# Altium schematic sheet P01_mpsm.SchDoc: Pixhawk Power Supply Module (PSM)
size C; SheetNumber: 1
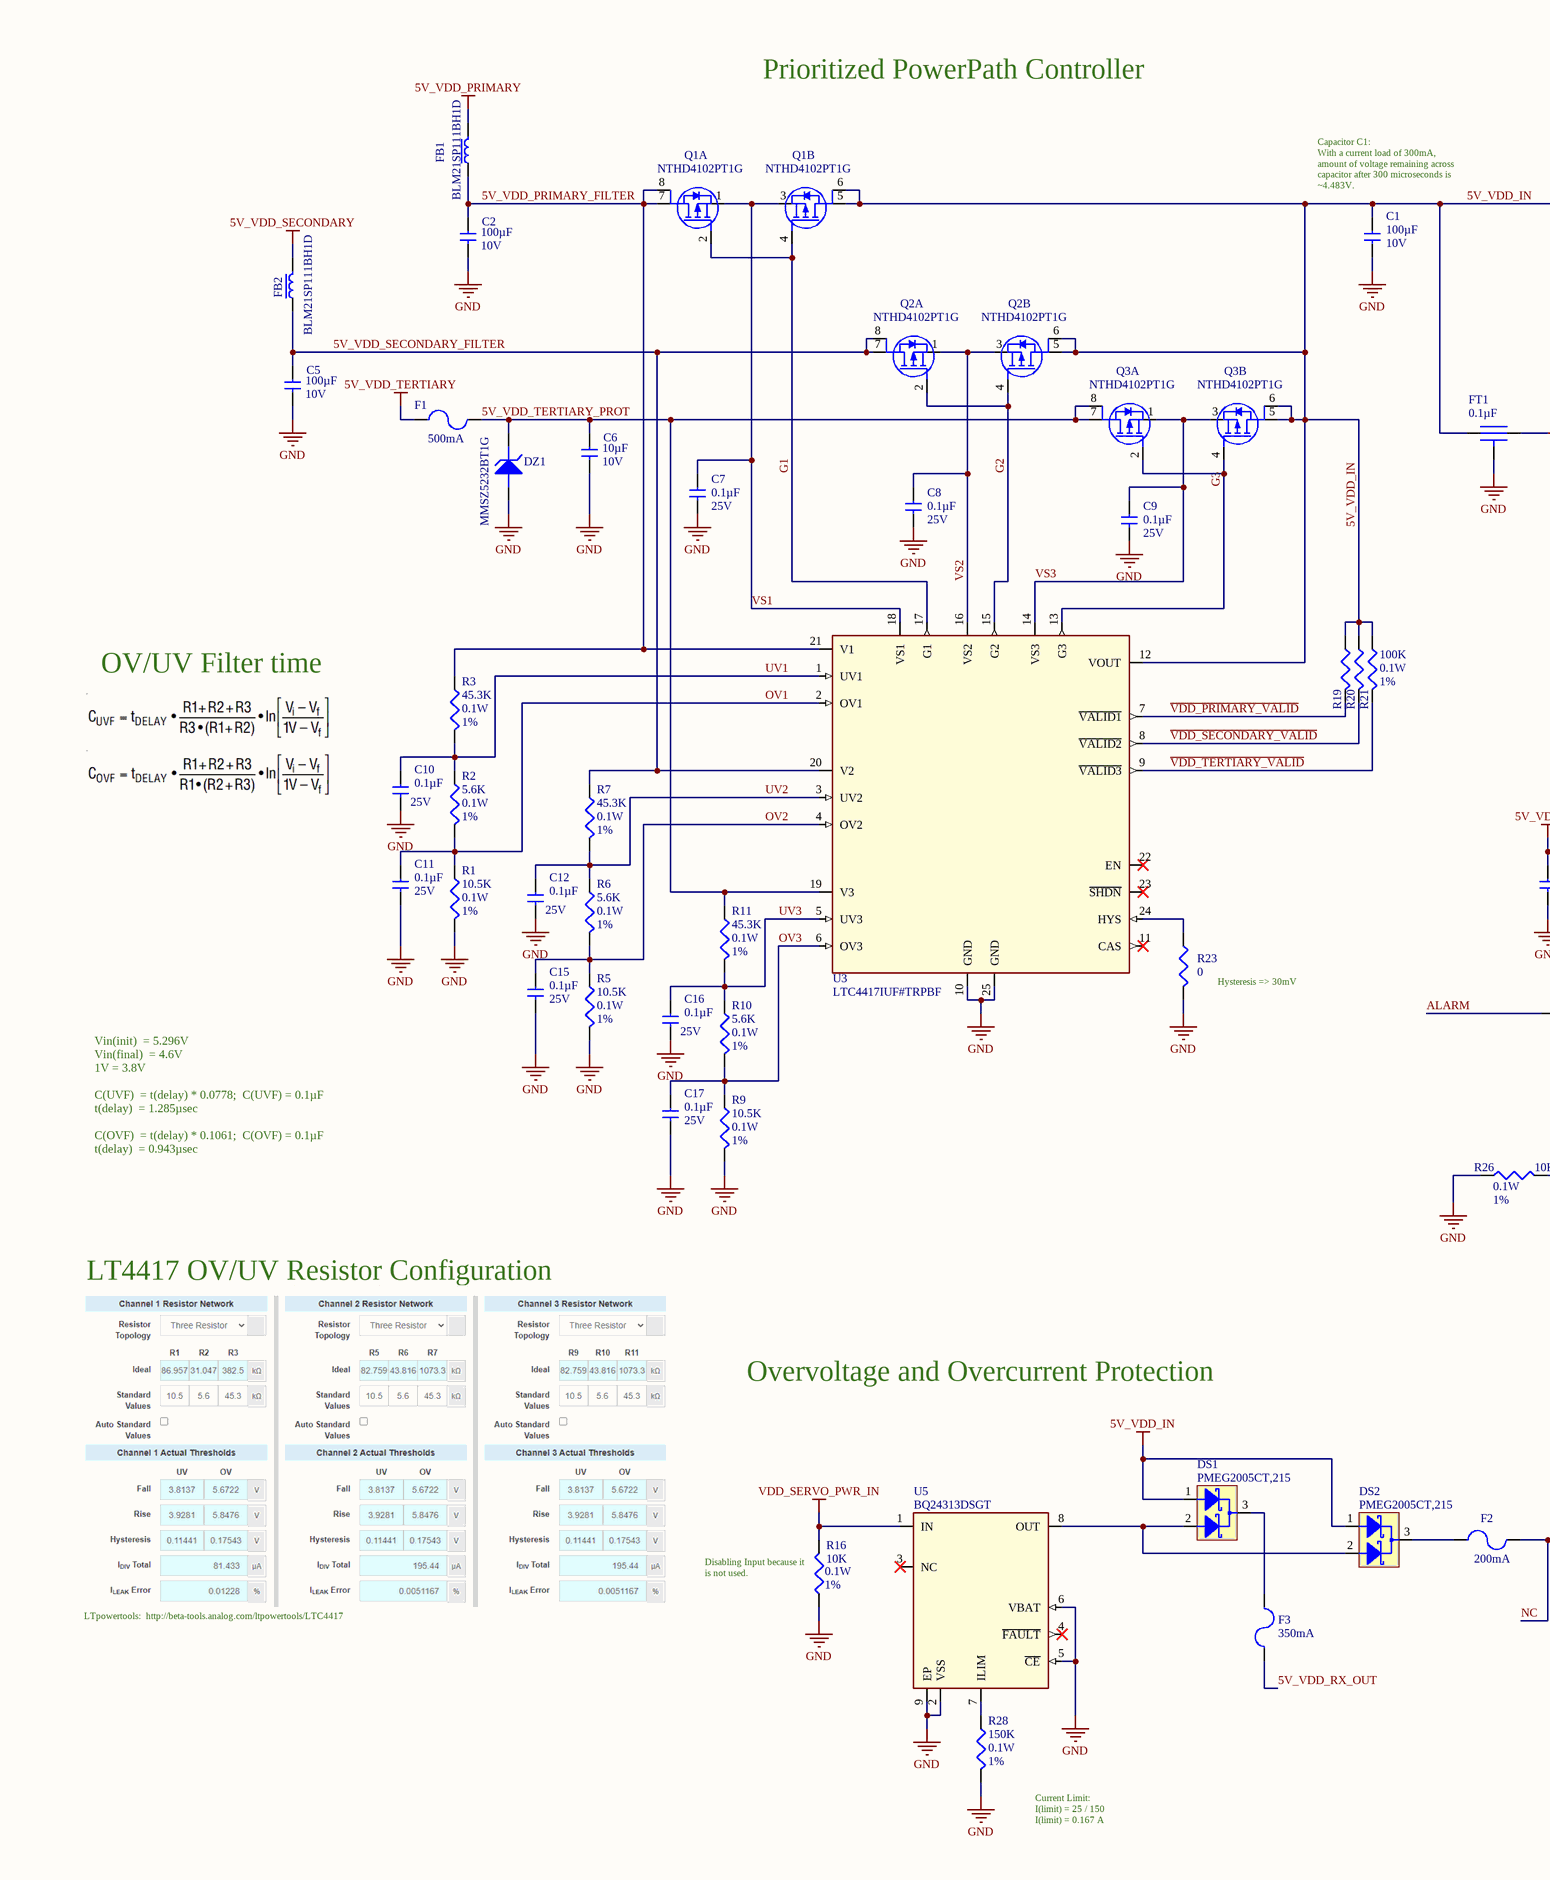
[diagram p0: P01_mpsm.SchDoc, left]
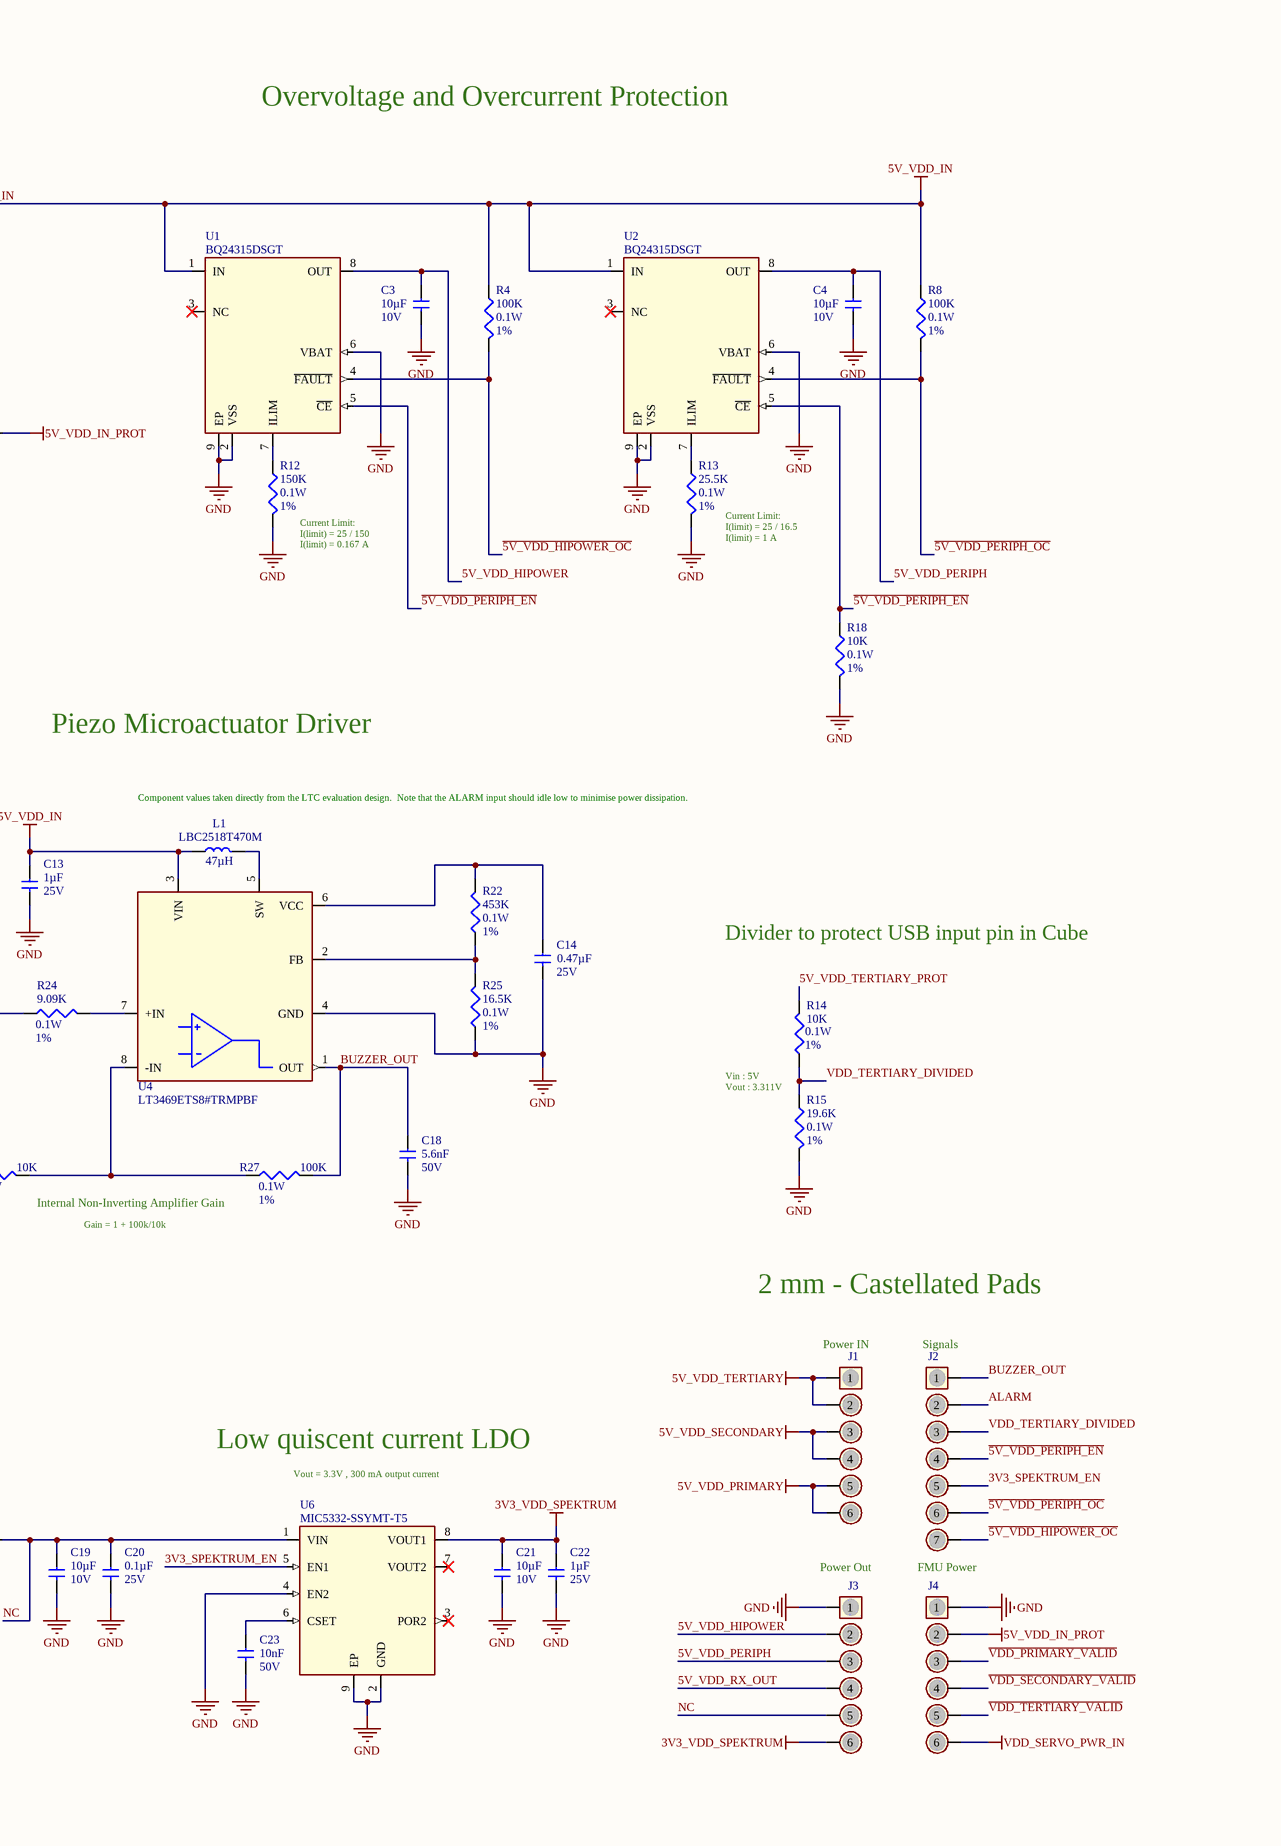
[diagram p1: P01_mpsm.SchDoc, right]

## Parts
C1  100µF  Voltage: 10V  [CC-1206]
C2  100µF  Voltage: 10V  [CC-1206]
C3  10µF  Voltage: 10V  [CC-0603]
C4  10µF  Voltage: 10V  [CC-0603]
C5  100µF  Voltage: 10V  [CC-1206]
C6  10µF  Voltage: 10V  [CC-0603]
C7  0.1µF  Voltage: 25V  [CC-0402]
C8  0.1µF  Voltage: 25V  [CC-0402]
C9  0.1µF  Voltage: 25V  [CC-0402]
C10  0.1µF  Voltage: 25V  [CC-0402]
C11  0.1µF  Voltage: 25V  [CC-0402]
C12  0.1µF  Voltage: 25V  [CC-0402]
C13  1µF  Voltage: 25V  [CC-0402]
C14  0.47µF  Voltage: 25V  [CC-0402]
C15  0.1µF  Voltage: 25V  [CC-0402]
C16  0.1µF  Voltage: 25V  [CC-0402]
C17  0.1µF  Voltage: 25V  [CC-0402]
C18  5.6nF  Voltage: 50V  [CC-0402]
C19  10µF  Voltage: 10V  [CC-0603]
C20  0.1µF  Voltage: 25V  [CC-0402]
C21  10µF  Voltage: 10V  [CC-0603]
C22  1µF  Voltage: 25V  [CC-0402]
C23  10nF  Voltage: 50V  [CC-0402]
DS1  PMEG2005CT,215  [SOT-23-3]
DS2  PMEG2005CT,215  [SOT-23-3]
DZ1  MMSZ5232BT1G  [SOD-123]
F1  500mA  [CF-0402]
F2  200mA  [CF-1206]
F3  350mA  [CF-1206]
FB1  BLM21SP111BH1D  [FB-0805]
FB2  BLM21SP111BH1D  [FB-0805]
FT1  0.1µF  [CF-0603 - 3PC-PAD]
J1  6 Contacts  [1X06M]  (value not drawn)  (no BOM)
J2  7 Contacts  [1X07M]  (value not drawn)  (no BOM)
J3  6 Contacts  [1X06M]  (value not drawn)  (no BOM)
J4  6 Contacts  [1X06M]  (value not drawn)  (no BOM)
L1  LBC2518T470M  Inductance: 47µH  [IND-1007]
Q1  NTHD4102PT1G  [1206-8_8-SMD]  (parts A,B of 2)
Q2  NTHD4102PT1G  [1206-8_8-SMD]  (parts A,B of 2)
Q3  NTHD4102PT1G  [1206-8_8-SMD]  (parts A,B of 2)
R1  10.5K  Power: 0.1W  Tolerance: 1%  [CR-0402]
R2  5.6K  Power: 0.1W  Tolerance: 1%  [CR-0402]
R3  45.3K  Power: 0.1W  Tolerance: 1%  [CR-0402]
R4  100K  Power: 0.1W  Tolerance: 1%  [CR-0402]
R5  10.5K  Power: 0.1W  Tolerance: 1%  [CR-0402]
R6  5.6K  Power: 0.1W  Tolerance: 1%  [CR-0402]
R7  45.3K  Power: 0.1W  Tolerance: 1%  [CR-0402]
R8  100K  Power: 0.1W  Tolerance: 1%  [CR-0402]
R9  10.5K  Power: 0.1W  Tolerance: 1%  [CR-0402]
R10  5.6K  Power: 0.1W  Tolerance: 1%  [CR-0402]
R11  45.3K  Power: 0.1W  Tolerance: 1%  [CR-0402]
R12  150K  Power: 0.1W  Tolerance: 1%  [CR-0402]
R13  25.5K  Power: 0.1W  Tolerance: 1%  [CR-0402]
R14  10K  Power: 0.1W  Tolerance: 1%  [CR-0402]
R15  19.6K  Power: 0.1W  Tolerance: 1%  [CR-0402]
R16  10K  Power: 0.1W  Tolerance: 1%  [CR-0402]
R18  10K  Power: 0.1W  Tolerance: 1%  [CR-0402]
R19  100K  [CR-0402]  (value not drawn)
R20  100K  [CR-0402]  (value not drawn)
R21  100K  Power: 0.1W  Tolerance: 1%  [CR-0402]
R22  453K  Power: 0.1W  Tolerance: 1%  [CR-0402]
R23  0  [CR-0402]
R24  9.09K  Power: 0.1W  Tolerance: 1%  [CR-0402]
R25  16.5K  Power: 0.1W  Tolerance: 1%  [CR-0402]
R26  10K  Power: 0.1W  Tolerance: 1%  [CR-0402]
R27  100K  Power: 0.1W  Tolerance: 1%  [CR-0402]
R28  150K  Power: 0.1W  Tolerance: 1%  [CR-0402]
U1  BQ24315DSGT  [8-WFDFN_2x2]
U2  BQ24315DSGT  [8-WFDFN_2x2]
U3  LTC4417IUF#TRPBF  [QFN-24_2x2]
U4  LT3469ETS8#TRMPBF  [SOT-23-8]
U5  BQ24313DSGT  [8-WFDFN_2x2]
U6  MIC5332-SSYMT-T5  [MLF-8_2x2]

## Nets
3V3_VDD_SPEKTRUM: C21.1 C22.1 J3.6 U6.8(VOUT1)
5V_VDD_IN: C1.1 C13.1 DS1.1(A1) DS2.1(A1) FT1.1 L1.1 Q1.5(D2) Q1.6(D2) Q2.5(D2) Q2.6(D2) Q3.5(D2) Q3.6(D2) R4.1 R8.1 R19.1 R20.1 R21.1 U1.1(IN) U2.1(IN) U3.12(VOUT) U4.3(VIN)
5V_VDD_IN_PROT: FT1.2 J4.2
5V_VDD_PRIMARY: FB1.2 J1.5 J1.6
5V_VDD_SECONDARY: FB2.2 J1.3 J1.4
5V_VDD_TERTIARY: F1.2(NEG) J1.1 J1.2
GND: C1.2 C2.2 C3.2 C4.2 C5.2 C6.2 C7.2 C8.2 C9.2 C10.2 C11.2 C12.2 C13.2 C14.2 C15.2 C16.2 C17.2 C18.2 C19.2 C20.2 C21.2 C22.2 C23.2 DZ1.A FT1.GND J3.1 J4.1 R1.2 R5.2 R9.2 R12.2 R13.2 R15.2 R16.1 R18.2 R23.2 R25.1 R26.1 R28.2 U1.2(VSS) U1.6(VBAT) U1.9(EP) U2.2(VSS) U2.6(VBAT) U2.9(EP) U3.10(GND) U3.25(GND) U4.4(GND) U5.2(VSS) U5.5(~{CE}) U5.6(VBAT) U5.9(EP) U6.2(GND) U6.4(EN2) U6.9(EP)
VDD_SERVO_PWR_IN: J4.6 R16.2 U5.1(IN)
3V3_SPEKTRUM_EN: J2.5 U6.5(EN1)
~{5V_VDD_HIPOWER_OC}: J2.7 R4.2 U1.4(~{FAULT})
~{5V_VDD_PERIPH_EN}: J2.4 R18.1 U1.5(~{CE}) U2.5(~{CE})
~{5V_VDD_PERIPH_OC}: J2.6 R8.2 U2.4(~{FAULT})
5V_VDD_HIPOWER: C3.1 J3.2 U1.8(OUT)
5V_VDD_PERIPH: C4.1 J3.3 U2.8(OUT)
5V_VDD_PRIMARY_FILTER: C2.1 FB1.1 Q1.7(D1) Q1.8(D1) R3.1 U3.21(V1)
5V_VDD_RX_OUT: F3.1 J3.4
5V_VDD_SECONDARY_FILTER: C5.1 FB2.1 Q2.7(D1) Q2.8(D1) R7.1 U3.20(V2)
5V_VDD_TERTIARY_PROT: C6.1 DZ1.K F1.1(POS) Q3.7(D1) Q3.8(D1) R11.1 R14.2 U3.19(V3)
ALARM: J2.2 R24.1
BUZZER_OUT: C18.1 J2.1 R27.2 U4.1(OUT)
G1: Q1.2(G1) Q1.4(G2) U3.17(G1)
G2: Q2.2(G1) Q2.4(G2) U3.15(G2)
G3: Q3.2(G1) Q3.4(G2) U3.13(G3)
NC: C19.1 C20.1 F2.2 J3.5 U6.1(VIN)
OV1: C11.1 R1.1 R2.2 U3.2(OV1)
OV2: C15.1 R5.1 R6.2 U3.4(OV2)
OV3: C17.1 R9.1 R10.2 U3.6(OV3)
UV1: C10.1 R2.1 R3.2 U3.1(UV1)
UV2: C12.1 R6.1 R7.2 U3.3(UV2)
UV3: C16.1 R10.1 R11.2 U3.5(UV3)
~{VDD_PRIMARY_VALID}: J4.3 R19.2 U3.7(~{VALID1})
~{VDD_SECONDARY_VALID}: J4.4 R20.2 U3.8(~{VALID2})
~{VDD_TERTIARY_VALID}: J4.5 R21.2 U3.9(~{VALID3})
VDD_TERTIARY_DIVIDED: J2.3 R14.1 R15.1
VS1: C7.1 Q1.1(S1) Q1.3(S2) U3.18(VS1)
VS2: C8.1 Q2.1(S1) Q2.3(S2) U3.16(VS2)
VS3: C9.1 Q3.1(S1) Q3.3(S2) U3.14(VS3)
NetC14_1: C14.1 R22.2 U4.6(VCC)
NetC23_1: C23.1 U6.6(CSET)
NetDS1_2: DS1.2(A2) DS2.2(A2) U5.8(OUT)
NetDS1_3: DS1.3(C) F3.2
NetDS2_3: DS2.3(C) F2.1
NetL1_2: L1.2 U4.5(SW)
NetR12_1: R12.1 U1.7(ILIM)
NetR13_1: R13.1 U2.7(ILIM)
NetR22_1: R22.1 R25.2 U4.2(FB)
NetR23_1: R23.1 U3.24(HYS)
NetR24_2: R24.2 U4.7(+IN)
NetR26_2: R26.2 R27.1 U4.8(-IN)
NetR28_1: R28.1 U5.7(ILIM)

Not connected (* = marked no-connect by the designer): U1 3(NC)*; U2 3(NC)*; U3 11(CAS)* 22(EN)* 23(~{SHDN})*; U5 3(NC)* 4(~{FAULT})*; U6 3(POR2)* 7(VOUT2)*

## Notes on the sheet
- Prioritized PowerPath Controller
- Overvoltage and Overcurrent Protection
- (near C1) Capacitor C1:
  With a current load of 300mA,
  amount of voltage remaining across capacitor after 300 microseconds is ~4.483V.
- (near R12) Current Limit:
  I(limit) = 25 / 150
  I(limit) = 0.167 A
- (near R13) Current Limit:
  I(limit) = 25 / 16.5
  I(limit) = 1 A
- OV/UV Filter time
- Piezo Microactuator Driver
- (near L1) Component values taken directly from
  the LTC evaluation design.
  Note that the ALARM input should idle
  low to minimise power dissipation.
- Divider to protect USB input pin in Cube
- (near R23) Hysteresis => 30mV
- Vin : 5V
  Vout : 3.311V
- Vin(init) 	= 5.296V
  Vin(final) 	= 4.6V
  1V	= 3.8V
  C(UVF) 	= t(delay) * 0.0778; 	C(UVF) = 0.1µF
  t(delay) 	= 1.285µsec
  C(OVF) 	= t(delay) * 0.1061; 	C(OVF) = 0.1µF
  t(delay) 	= 0.943µsec
- Internal Non-Inverting Amplifier Gain
- LT4417 OV/UV Resistor Configuration
- Gain = 1 + 100k/10k
- 2 mm - Castellated Pads
- (near J1) Power IN
- (near J2) Signals
- Vout = 3.3V , 300 mA output current
- Low quiscent current LDO
- LTpowertools:  http://beta-tools.analog.com/ltpowertools/LTC4417
- (near R16) Disabling Input because it is not used.
- Power Out
- FMU Power
- Current Limit:
  I(limit) = 25 / 150
  I(limit) = 0.167 A
- Title
- Assembly Number:
- Revision
- PROPRIETRY & CONFIDENTIAL
  THE INFORMATION CONTAINS IN THIS DRAWING
  IS THE SOLE PROPERTY OF  MATTERNET Inc.
  ANY REPRODUCTION IN PART OR AS WHOLE
  WITHOUT A WRITTEN PERMISSION OF
  MATTERNET Inc. IS PROHIBITED
- Size:
- Date:
- File:
- C
- Fabrication Number:
- Time:
- Sheet
- of

## Library data of the parts
C1 C2 C5 = CC-100µF-X5R-10V-20%-1206: DESC: 100µF ±20% 10V Ceramic Capacitor X5R 1206 (3216 Metric); MFG: TDK Corporation; MFG_PN: C3216X5R1A107M160AC; Tolerance: 20%
C3 C4 C6 C19 C21 = CC-10µF-X7T-10V-10%-0603: DESC: 10µF ±10% 10V Ceramic Capacitor X7T 0603 (1608 Metric); MFG: Murata Electronics; MFG_PN: GRM188D71A106KA73D; Tolerance: 10%
C7-C12 C15-C17 C20 = CC-0.1µF-X7R-25V-10%-0402: DESC: 0.1µF ±10% 25V Ceramic Capacitor X7R 0402 (1005 Metric); MFG: Murata Electronics; MFG_PN: GRM155R71E104KE14D; Tolerance: 10%
C13 C22 = CC-1µF-X6S-25V-10%-0402: DESC: 1µF ±10% 25V Ceramic Capacitor X6S 0402 (1005 Metric); MFG: Murata Electronics; MFG_PN: GRT155C81E105KE13D; Tolerance: 10%
C14 = CC-0.47µF-X5R-25V-10%-0402: Tolerance: ±10%; DESC: 0.47µF ±10% 25V Ceramic Capacitor X5R 0402 (1005 Metric); MFG: Murata Electronics; MFG_PN: GRT155R61E474KE01D
C18 = CC-5.6nF-X7R-50V-5%-0402: Tolerance: ±10%; DESC: 5600pF ±5% 50V Ceramic Capacitor X7R 0402 (1005 Metric); MFG: Yageo; MFG_PN: CC0402JRX7R9BB562
C23 = CC-10nF-X7R-50V-10%-0402: Tolerance: ±10%; DESC: 10000pF ±10% 50V Ceramic Capacitor X7R 0402 (1005 Metric); MFG: Murata Electronics; MFG_PN: GRM155R71H103KA88D
DS1 DS2 = DS-PMEG2005CT,215-SOT-23-3: MFG: Nexperia USA Inc.; DESC: Diode Array 1 Pair Common Cathode Schottky 20V 500mA Surface Mount TO-236-3, SC-59, SOT-23-3; MFG_PN: PMEG2005CT,215
DZ1 = DZ-5.6V-MMSZ5232BT1G-SOD-123: MFG: ON Semiconductor; DESC: Zener Diode 5.6V 500mW ±5% Surface Mount SOD-123; MFG_PN: MMSZ5232BT1G
F1 = FUSE-500mA-32V-0402: DESC: FUSE BOARD MNT 500MA 24VDC 0402; MFG: BOURNS; MFG_PN: SF-0402F050-2
F2 = FUSE-200mA-20V-1206: DESC: Polymeric PTC Resettable Fuse 30V 200mA Ih Surface Mount 1206 (3216 Metric), Concave; MFG: Bel Fuse Inc.; MFG_PN: 0ZCJ0020FF2E
F3 = FUSE-350mA-16V-1206: DESC: Polymeric PTC Resettable Fuse 16V 350mA Ih Surface Mount 1206 (3216 Metric), Concave; MFG: Littelfuse Inc.; MFG_PN: 1206L035/16YR
FB1 FB2 = FB-BLM21SP111BH1D-0805: DESC: 110 Ohms @ 100MHz 1 Power Line Ferrite Bead 0805 (2012 Metric) 5A; MFG: Murata Electronics; MFG_PN: BLM21SP111BH1D
FT1 = CAP FT-0.1µF-X7R-16V-20%-0603: DESC: 0.1µF Feed Through Capacitor 16V 2A 30mOhm 0603 (1608 Metric), 3 PC Pad; MFG: Murata Electronics; MFG_PN: NFM18PC104R1C3D
J1 J3 J4 = 6-Pin-Contact-PSM: Manufacturer: TE Connectivity Aerospace, Defense and Marine; Manufacturer Part Number: 205089-1; Part Description: CONN PIN 20-24AWG GOLD CRIMP; Case/Package: 1mm-TH; RoHS: Y; Supplier 1: Digikey; Supplier Part Number 1: A2160-ND
J2 = 7-Pin-Contact-PSM: Manufacturer: TE Connectivity Aerospace, Defense and Marine; Manufacturer Part Number: 205089-1; Part Description: CONN PIN 20-24AWG GOLD CRIMP; Case/Package: 1mm-TH; RoHS: Y; Supplier 1: Digikey; Supplier Part Number 1: A2160-ND
L1 = IND-47µH-165mA-1.9Ohm-1007: DESC: 47µH Unshielded Wirewound Inductor 165mA 1.9Ohm 1007 (2518 Metric); MFG: Taiyo Yuden; MFG_PN: LBC2518T470M
Q1-Q3 = MOSFET-P 2CH-NTHD4102PT1G-8-SMD: MFG: ON Semiconductor; DESC: Mosfet Array 2 P-Channel (Dual) 20V 2.9A 1.1W Surface Mount ChipFET™; MFG_PN: NTHD4102PT1G
R1 R5 R9 = CR-10.5K-1/10W-1%-0402: DESC: 10.5 kOhms ±1% 0.1W, 1/10W Chip Resistor 0402 (1005 Metric) Automotive AEC-Q200 Thick Film; MFG: Panasonic Electronic Components; MFG_PN: ERJ-2RKF1052X
R2 R6 R10 = CR-5.6K-1/10W-1%-0402: DESC: 5.6 kOhms ±1% 0.1W, 1/10W Chip Resistor 0402 (1005 Metric) Automotive AEC-Q200 Thick Film; MFG: Panasonic Electronic Components; MFG_PN: ERJ-2RKF5601X
R3 R7 R11 = CR- 45.3K-1/10W-1%-0402: DESC: 45.3 kOhms ±1% 0.1W, 1/10W Chip Resistor 0402 (1005 Metric) Automotive AEC-Q200 Thick Film; MFG: Panasonic Electronic Components; MFG_PN: ERJ-2RKF4532X
R4 R8 R21 R27 = CR-100K-1/10W-1%-0402: DESC: 100 kOhms ±1% 0.1W, 1/10W Chip Resistor 0402 (1005 Metric) Automotive AEC-Q200 Thick Film; MFG: Panasonic Electronic Components; MFG_PN: ERJ-2RKF1003X
R12 R28 = CR-150K-1/10W-1%-0402: DESC: 150 kOhms ±1% 0.1W, 1/10W Chip Resistor 0402 (1005 Metric) Automotive AEC-Q200 Thick Film; MFG: Panasonic Electronic Components; MFG_PN: ERJ-2RKF1503X
R13 = CR-25.5K-1/10W-1%-0402: DESC: 25.5 kOhms ±1% 0.1W, 1/10W Chip Resistor 0402 (1005 Metric) Automotive AEC-Q200 Thick Film; MFG: Panasonic Electronic Components; MFG_PN: ERJ-2RKF2552X
R14 R16 R18 R26 = CR-10K-1/10W-1%-0402: DESC: 10 kOhms ±1% 0.1W, 1/10W Chip Resistor 0402 (1005 Metric) Automotive AEC-Q200 Thick Film; MFG: Panasonic Electronic Components; MFG_PN: ERJ-2RKF1002X
R15 = CR-19.6K-1/10W-1%-0402: DESC: 19.6 kOhms ±1% 0.1W, 1/10W Chip Resistor 0402 (1005 Metric) Automotive AEC-Q200 Thick Film; MFG: Panasonic Electronic Components; MFG_PN: ERJ-2RKF1962X
R19 R20 = CR-100K-1/10W-1%-0402: DESC: 100 kOhms ±1% 0.1W, 1/10W Chip Resistor 0402 (1005 Metric) Automotive AEC-Q200 Thick Film; MFG: Panasonic Electronic Components; MFG_PN: ERJ-2RKF1003X; Power: 0.1W; Tolerance: 1%
R22 = CR- 453K-1/10W-1%-0402: DESC: 453 kOhms ±1% 0.1W, 1/10W Chip Resistor 0402 (1005 Metric) Automotive AEC-Q200 Thick Film; MFG: Panasonic Electronic Components; MFG_PN: ERJ-2RKF4533X
R23 = CR-0.0-1/10W-1%-0402: DESC: 0 Ohms Jumper 0.1W, 1/10W Chip Resistor 0402 (1005 Metric) Automotive AEC-Q200 Thick Film; MFG: Panasonic Electronic Components; MFG_PN: ERJ-2GE0R00X; Tolerance: 1%; Power: 0.1W
R24 = CR-9.09K-1/10W-1%-0402: DESC: 9.09 kOhms ±1% 0.1W, 1/10W Chip Resistor 0402 (1005 Metric) Automotive AEC-Q200 Thick Film; MFG: Panasonic Electronic Components; MFG_PN: ERJ-2RKF9091X
R25 = CR-16.5K-1/10W-1%-0402: DESC: 16.5 kOhms ±1% 0.1W, 1/10W Chip Resistor 0402 (1005 Metric) Automotive AEC-Q200 Thick Film; MFG: Panasonic Electronic Components; MFG_PN: ERJ-2RKF1652X
U1 U2 = IC-BQ24315DSGT-8-WFDFN: DESC: Battery Battery Protection IC Lithium-Ion 8-WSON (2x2); MFG: Texas Instruments; MFG_PN: BQ24315DSGT
U3 = IC-LTC4417IUF-24-QFN: DESC: OR Controller Source Selector Switch P-Channel 3:1 24-QFN (4x4); MFG: Analog Devices Inc.; MFG_PN: LTC4417IUF#TRPBF
U4 = IC-LT3469ETS8-TSOT-23-8: DESC: Transconductance IC Piezo Speakers, Microactuators TSOT-23-8; MFG: Analog Devices Inc.; MFG_PN: LT3469ETS8#TRMPBF
U5 = IC-BQ24313DSGT-8-WFDFN: DESC: Battery Battery Protection IC Lithium-Ion 8-WSON (2x2); MFG: Texas Instruments; MFG_PN: BQ24313DSGT
U6 = IC-MIC5332-8-MLF: DESC: Linear Voltage Regulator IC  2 Output  300mA, 300mA 8-MLF® (2x2); MFG: Microchip Technology; MF_PN: MIC5332-SSYMT-T5